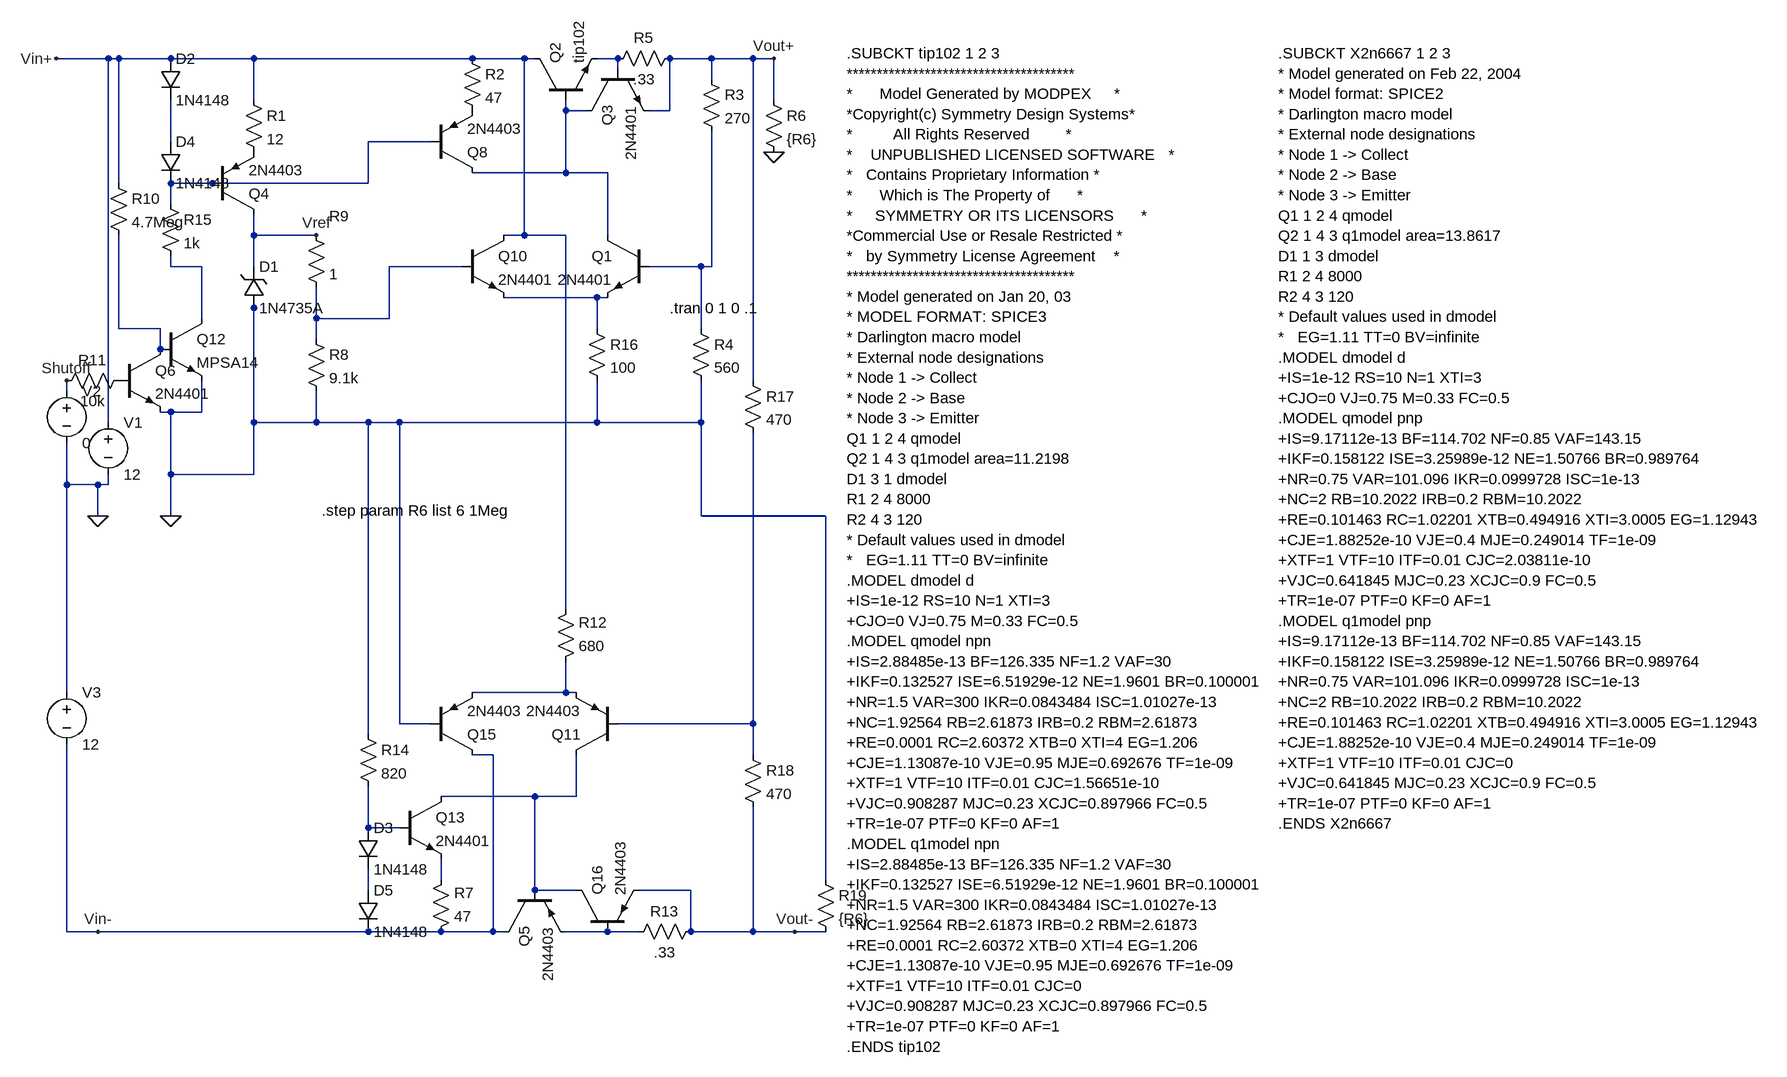
[diagram p0: schematic TrackingSupplyWithShutdown.asc]
TrackingSupplyWithShutdown.asc, the LTspice schematic file:
Version 4
SHEET 1 2144 1524
WIRE -496 -48 -576 -48
WIRE -480 -48 -496 -48
WIRE -400 -48 -480 -48
WIRE -272 -48 -400 -48
WIRE 64 -48 -272 -48
WIRE 144 -48 64 -48
WIRE 160 -48 144 -48
WIRE 288 -48 256 -48
WIRE 432 -48 368 -48
WIRE 496 -48 432 -48
WIRE 528 -48 496 -48
WIRE 288 -32 288 -48
WIRE 432 -16 432 -48
WIRE -272 16 -272 -48
WIRE 528 16 528 -48
WIRE 208 32 208 16
WIRE 240 32 208 32
WIRE 368 32 368 -48
WIRE 368 32 336 32
WIRE -400 80 -400 16
WIRE 0 80 -96 80
WIRE 208 128 208 32
WIRE 208 128 64 128
WIRE 272 128 208 128
WIRE -480 144 -480 -48
WIRE -336 144 -400 144
WIRE -96 144 -96 80
WIRE -96 144 -336 144
WIRE -400 176 -400 144
WIRE -272 224 -272 192
WIRE -176 224 -272 224
WIRE 144 224 144 -48
WIRE 144 224 112 224
WIRE 208 224 144 224
WIRE 272 224 272 128
WIRE -400 272 -400 256
WIRE -352 272 -400 272
WIRE -272 272 -272 224
WIRE 48 272 -64 272
WIRE 416 272 336 272
WIRE 432 272 432 64
WIRE 432 272 416 272
WIRE 256 320 112 320
WIRE 272 320 256 320
WIRE -272 336 -272 320
WIRE -352 352 -352 272
WIRE -176 352 -176 304
WIRE -64 352 -64 272
WIRE -64 352 -176 352
WIRE -480 368 -480 224
WIRE -416 368 -480 368
WIRE 256 368 256 320
WIRE 416 368 416 272
WIRE -176 384 -176 352
WIRE -416 400 -416 368
WIRE 496 448 496 -48
WIRE -560 464 -560 448
WIRE -400 496 -416 496
WIRE -352 496 -352 448
WIRE -352 496 -400 496
WIRE -496 512 -496 -48
WIRE -272 512 -272 336
WIRE -176 512 -176 464
WIRE -176 512 -272 512
WIRE -96 512 -176 512
WIRE -48 512 -96 512
WIRE 256 512 256 448
WIRE 256 512 -48 512
WIRE 416 512 416 448
WIRE 416 512 256 512
WIRE -400 592 -400 496
WIRE -272 592 -272 512
WIRE -272 592 -400 592
WIRE -560 608 -560 544
WIRE -512 608 -560 608
WIRE -496 608 -496 592
WIRE -496 608 -512 608
WIRE -512 656 -512 608
WIRE -400 656 -400 592
WIRE 416 656 416 512
WIRE 608 656 416 656
WIRE 208 800 208 224
WIRE -560 928 -560 608
WIRE 208 928 208 880
WIRE 208 928 64 928
WIRE 224 928 208 928
WIRE -48 976 -48 512
WIRE 0 976 -48 976
WIRE 496 976 496 528
WIRE 496 976 288 976
WIRE -96 992 -96 512
WIRE 96 1024 64 1024
WIRE 496 1024 496 976
WIRE 160 1088 16 1088
WIRE 224 1088 224 1024
WIRE 224 1088 160 1088
WIRE -96 1136 -96 1072
WIRE -48 1136 -96 1136
WIRE 16 1216 16 1184
WIRE 608 1216 608 656
WIRE -96 1232 -96 1200
WIRE 160 1232 160 1088
WIRE 224 1232 160 1232
WIRE 400 1232 320 1232
WIRE -560 1296 -560 1008
WIRE -512 1296 -560 1296
WIRE -96 1296 -512 1296
WIRE 16 1296 -96 1296
WIRE 96 1296 96 1024
WIRE 96 1296 16 1296
WIRE 112 1296 96 1296
WIRE 272 1296 208 1296
WIRE 320 1296 272 1296
WIRE 400 1296 400 1232
WIRE 496 1296 496 1104
WIRE 496 1296 400 1296
WIRE 560 1296 496 1296
WIRE 608 1296 560 1296
FLAG -576 -48 Vin+
FLAG 528 -48 Vout+
FLAG -176 224 Vref
FLAG -512 656 0
FLAG 528 96 0
FLAG -400 656 0
FLAG -560 448 Shutoff
FLAG -512 1296 Vin-
FLAG 560 1296 Vout-
SYMBOL zener -288 336 M180
WINDOW 0 24 64 Left 2
WINDOW 3 24 0 Left 2
SYMATTR InstName D1
SYMATTR Value 1N4735A
SYMBOL npn 336 224 M0
SYMATTR InstName Q1
SYMATTR Value 2N4401
SYMBOL res 416 -32 R0
SYMATTR InstName R3
SYMATTR Value 270
SYMBOL res 400 352 R0
SYMATTR InstName R4
SYMATTR Value 560
SYMBOL npn 160 16 R270
SYMATTR InstName Q2
SYMATTR Value tip102
SYMATTR Prefix X
SYMBOL voltage -496 496 R0
WINDOW 123 0 0 Left 2
WINDOW 39 0 0 Left 2
SYMATTR InstName V1
SYMATTR Value 12
SYMBOL res 384 -64 R90
WINDOW 0 0 56 VBottom 2
WINDOW 3 32 56 VTop 2
SYMATTR InstName R5
SYMATTR Value .33
SYMBOL npn 240 -32 M90
SYMATTR InstName Q3
SYMATTR Value 2N4401
SYMBOL res 512 0 R0
SYMATTR InstName R6
SYMATTR Value {R6}
SYMBOL diode -416 -48 R0
SYMATTR InstName D2
SYMATTR Value 1N4148
SYMBOL diode -416 80 R0
SYMATTR InstName D4
SYMATTR Value 1N4148
SYMBOL pnp -336 192 M180
SYMATTR InstName Q4
SYMATTR Value 2N4403
SYMBOL res -288 0 R0
SYMATTR InstName R1
SYMATTR Value 12
SYMBOL res -192 368 R0
SYMATTR InstName R8
SYMATTR Value 9.1k
SYMBOL res -192 208 R0
WINDOW 0 36 -13 Left 2
SYMATTR InstName R9
SYMATTR Value 1
SYMBOL voltage -560 448 R0
WINDOW 123 0 0 Left 2
WINDOW 39 0 0 Left 2
SYMATTR InstName V2
SYMATTR Value 0
SYMBOL pnp 0 128 M180
SYMATTR InstName Q8
SYMATTR Value 2N4403
SYMBOL res 48 -64 R0
SYMATTR InstName R2
SYMATTR Value 47
SYMBOL npn 48 224 R0
SYMATTR InstName Q10
SYMATTR Value 2N4401
SYMBOL npn -480 400 R0
SYMATTR InstName Q6
SYMATTR Value 2N4401
SYMBOL npn -416 352 R0
SYMATTR InstName Q12
SYMATTR Value MPSA14
SYMBOL res -496 128 R0
SYMATTR InstName R10
SYMATTR Value 4.7Meg
SYMBOL res -464 432 R90
WINDOW 0 0 56 VBottom 2
WINDOW 3 32 56 VTop 2
SYMATTR InstName R11
SYMATTR Value 10k
SYMBOL res -416 160 R0
SYMATTR InstName R15
SYMATTR Value 1k
SYMBOL res 240 352 R0
SYMATTR InstName R16
SYMATTR Value 100
SYMBOL pnp 288 1024 R180
SYMATTR InstName Q11
SYMATTR Value 2N4403
SYMBOL res 0 1312 M180
WINDOW 0 36 76 Left 2
WINDOW 3 36 40 Left 2
SYMATTR InstName R7
SYMATTR Value 47
SYMBOL npn -48 1088 R0
SYMATTR InstName Q13
SYMATTR Value 2N4401
SYMBOL res 192 896 M180
WINDOW 0 36 76 Left 2
WINDOW 3 36 40 Left 2
SYMATTR InstName R12
SYMATTR Value 680
SYMBOL pnp 0 1024 M180
SYMATTR InstName Q15
SYMATTR Value 2N4403
SYMBOL pnp 224 1296 R270
SYMATTR InstName Q16
SYMATTR Value 2N4403
SYMBOL res 416 1280 R90
WINDOW 0 0 56 VBottom 2
WINDOW 3 32 56 VTop 2
SYMATTR InstName R13
SYMATTR Value .33
SYMBOL voltage -560 912 R0
WINDOW 123 0 0 Left 2
WINDOW 39 0 0 Left 2
SYMATTR InstName V3
SYMATTR Value 12
SYMBOL diode -112 1136 R0
SYMATTR InstName D3
SYMATTR Value 1N4148
SYMBOL diode -112 1232 R0
SYMATTR InstName D5
SYMATTR Value 1N4148
SYMBOL res -112 976 R0
SYMATTR InstName R14
SYMATTR Value 820
SYMBOL res 480 432 R0
SYMATTR InstName R17
SYMATTR Value 470
SYMBOL res 480 1008 R0
SYMATTR InstName R18
SYMATTR Value 470
SYMBOL res 592 1200 R0
SYMATTR InstName R19
SYMATTR Value {R6}
SYMBOL pnp 112 1232 M90
SYMATTR InstName Q5
SYMATTR Value 2N4403
TEXT 368 336 Left 2 !.tran 0 1 0 .1
TEXT 640 -56 Left 2 !.SUBCKT tip102 1 2 3\n**************************************\n*      Model Generated by MODPEX     *\n*Copyright(c) Symmetry Design Systems*\n*         All Rights Reserved        *\n*    UNPUBLISHED LICENSED SOFTWARE   *\n*   Contains Proprietary Information *\n*      Which is The Property of      *\n*     SYMMETRY OR ITS LICENSORS      *\n*Commercial Use or Resale Restricted *\n*   by Symmetry License Agreement    *\n**************************************\n* Model generated on Jan 20, 03\n* MODEL FORMAT: SPICE3\n* Darlington macro model\n* External node designations\n* Node 1 -> Collect\n* Node 2 -> Base\n* Node 3 -> Emitter\nQ1 1 2 4 qmodel\nQ2 1 4 3 q1model area=11.2198\nD1 3 1 dmodel\nR1 2 4 8000\nR2 4 3 120\n* Default values used in dmodel\n*   EG=1.11 TT=0 BV=infinite\n.MODEL dmodel d\n+IS=1e-12 RS=10 N=1 XTI=3\n+CJO=0 VJ=0.75 M=0.33 FC=0.5\n.MODEL qmodel npn\n+IS=2.88485e-13 BF=126.335 NF=1.2 VAF=30\n+IKF=0.132527 ISE=6.51929e-12 NE=1.9601 BR=0.100001\n+NR=1.5 VAR=300 IKR=0.0843484 ISC=1.01027e-13\n+NC=1.92564 RB=2.61873 IRB=0.2 RBM=2.61873\n+RE=0.0001 RC=2.60372 XTB=0 XTI=4 EG=1.206\n+CJE=1.13087e-10 VJE=0.95 MJE=0.692676 TF=1e-09\n+XTF=1 VTF=10 ITF=0.01 CJC=1.56651e-10\n+VJC=0.908287 MJC=0.23 XCJC=0.897966 FC=0.5\n+TR=1e-07 PTF=0 KF=0 AF=1\n.MODEL q1model npn\n+IS=2.88485e-13 BF=126.335 NF=1.2 VAF=30\n+IKF=0.132527 ISE=6.51929e-12 NE=1.9601 BR=0.100001\n+NR=1.5 VAR=300 IKR=0.0843484 ISC=1.01027e-13\n+NC=1.92564 RB=2.61873 IRB=0.2 RBM=2.61873\n+RE=0.0001 RC=2.60372 XTB=0 XTI=4 EG=1.206\n+CJE=1.13087e-10 VJE=0.95 MJE=0.692676 TF=1e-09\n+XTF=1 VTF=10 ITF=0.01 CJC=0\n+VJC=0.908287 MJC=0.23 XCJC=0.897966 FC=0.5\n+TR=1e-07 PTF=0 KF=0 AF=1\n.ENDS tip102
TEXT -168 648 Left 2 !.step param R6 list 6 1Meg
TEXT 1304 -56 Left 2 !.SUBCKT X2n6667 1 2 3\n* Model generated on Feb 22, 2004\n* Model format: SPICE2\n* Darlington macro model\n* External node designations\n* Node 1 -> Collect\n* Node 2 -> Base\n* Node 3 -> Emitter\nQ1 1 2 4 qmodel\nQ2 1 4 3 q1model area=13.8617\nD1 1 3 dmodel\nR1 2 4 8000\nR2 4 3 120\n* Default values used in dmodel\n*   EG=1.11 TT=0 BV=infinite\n.MODEL dmodel d\n+IS=1e-12 RS=10 N=1 XTI=3\n+CJO=0 VJ=0.75 M=0.33 FC=0.5\n.MODEL qmodel pnp\n+IS=9.17112e-13 BF=114.702 NF=0.85 VAF=143.15\n+IKF=0.158122 ISE=3.25989e-12 NE=1.50766 BR=0.989764\n+NR=0.75 VAR=101.096 IKR=0.0999728 ISC=1e-13\n+NC=2 RB=10.2022 IRB=0.2 RBM=10.2022\n+RE=0.101463 RC=1.02201 XTB=0.494916 XTI=3.0005 EG=1.12943\n+CJE=1.88252e-10 VJE=0.4 MJE=0.249014 TF=1e-09\n+XTF=1 VTF=10 ITF=0.01 CJC=2.03811e-10\n+VJC=0.641845 MJC=0.23 XCJC=0.9 FC=0.5\n+TR=1e-07 PTF=0 KF=0 AF=1\n.MODEL q1model pnp\n+IS=9.17112e-13 BF=114.702 NF=0.85 VAF=143.15\n+IKF=0.158122 ISE=3.25989e-12 NE=1.50766 BR=0.989764\n+NR=0.75 VAR=101.096 IKR=0.0999728 ISC=1e-13\n+NC=2 RB=10.2022 IRB=0.2 RBM=10.2022\n+RE=0.101463 RC=1.02201 XTB=0.494916 XTI=3.0005 EG=1.12943\n+CJE=1.88252e-10 VJE=0.4 MJE=0.249014 TF=1e-09\n+XTF=1 VTF=10 ITF=0.01 CJC=0\n+VJC=0.641845 MJC=0.23 XCJC=0.9 FC=0.5\n+TR=1e-07 PTF=0 KF=0 AF=1\n.ENDS X2n6667

The netlist it stands for:
* TrackingSupplyWithShutdown.asc
D1 0 Vref 1N4735A
Q1 N002 N007 N008 0 2N4401
R3 Vout+ N007 270
R4 N007 0 560
XQ2 Vin+ N002 N001 tip102  ; pins C B E
V1 Vin+ 0 12
R5 Vout+ N001 .33
Q3 N002 N001 Vout+ 0 2N4401
R6 Vout+ 0 {R6}
D2 Vin+ N003 1N4148
D4 N003 N004 1N4148
Q4 Vref N004 P001 0 2N4403
R1 Vin+ P001 12
R8 N006 0 9.1k
R9 Vref N006 1
V2 Shutoff 0 0
Q8 N002 N004 P002 0 2N4403
R2 Vin+ P002 47
Q10 Vin+ N006 N008 0 2N4401
Q6 N009 P003 0 0 2N4401
Q12 N005 N009 0 0 MPSA14
R10 Vin+ N009 4.7Meg
R11 P003 Shutoff 10k
R15 N004 N005 1k
R16 N008 0 100
Q11 N012 N011 N010 0 2N4403
R7 Vin- N014 47
Q13 N012 N013 N014 0 2N4401
R12 N010 Vin+ 680
Q15 Vin- 0 N010 0 2N4403
Q16 N012 N016 Vout- 0 2N4403
R13 Vout- N016 .33
V3 0 Vin- 12
D3 N013 N015 1N4148
D5 N015 Vin- 1N4148
R14 0 N013 820
R17 Vout+ N011 470
R18 N011 Vout- 470
R19 0 Vout- {R6}
Q5 Vin- N012 N016 0 2N4403
.model D D
.lib standard.dio
.model NPN NPN
.model PNP PNP
.lib standard.bjt
.tran 0 1 0 .1
.SUBCKT tip102 1 2 3
**************************************
*      Model Generated by MODPEX     *
*Copyright(c) Symmetry Design Systems*
*         All Rights Reserved        *
*    UNPUBLISHED LICENSED SOFTWARE   *
*   Contains Proprietary Information *
*      Which is The Property of      *
*     SYMMETRY OR ITS LICENSORS      *
*Commercial Use or Resale Restricted *
*   by Symmetry License Agreement    *
**************************************
* Model generated on Jan 20, 03
* MODEL FORMAT: SPICE3
* Darlington macro model
* External node designations
* Node 1 -> Collect
* Node 2 -> Base
* Node 3 -> Emitter
Q1 1 2 4 qmodel
Q2 1 4 3 q1model area=11.2198
D1 3 1 dmodel
R1 2 4 8000
R2 4 3 120
* Default values used in dmodel
*   EG=1.11 TT=0 BV=infinite
.MODEL dmodel d
+IS=1e-12 RS=10 N=1 XTI=3
+CJO=0 VJ=0.75 M=0.33 FC=0.5
.MODEL qmodel npn
+IS=2.88485e-13 BF=126.335 NF=1.2 VAF=30
+IKF=0.132527 ISE=6.51929e-12 NE=1.9601 BR=0.100001
+NR=1.5 VAR=300 IKR=0.0843484 ISC=1.01027e-13
+NC=1.92564 RB=2.61873 IRB=0.2 RBM=2.61873
+RE=0.0001 RC=2.60372 XTB=0 XTI=4 EG=1.206
+CJE=1.13087e-10 VJE=0.95 MJE=0.692676 TF=1e-09
+XTF=1 VTF=10 ITF=0.01 CJC=1.56651e-10
+VJC=0.908287 MJC=0.23 XCJC=0.897966 FC=0.5
+TR=1e-07 PTF=0 KF=0 AF=1
.MODEL q1model npn
+IS=2.88485e-13 BF=126.335 NF=1.2 VAF=30
+IKF=0.132527 ISE=6.51929e-12 NE=1.9601 BR=0.100001
+NR=1.5 VAR=300 IKR=0.0843484 ISC=1.01027e-13
+NC=1.92564 RB=2.61873 IRB=0.2 RBM=2.61873
+RE=0.0001 RC=2.60372 XTB=0 XTI=4 EG=1.206
+CJE=1.13087e-10 VJE=0.95 MJE=0.692676 TF=1e-09
+XTF=1 VTF=10 ITF=0.01 CJC=0
+VJC=0.908287 MJC=0.23 XCJC=0.897966 FC=0.5
+TR=1e-07 PTF=0 KF=0 AF=1
.ENDS tip102
.step param R6 list 6 1Meg
.SUBCKT X2n6667 1 2 3
* Model generated on Feb 22, 2004
* Model format: SPICE2
* Darlington macro model
* External node designations
* Node 1 -> Collect
* Node 2 -> Base
* Node 3 -> Emitter
Q1 1 2 4 qmodel
Q2 1 4 3 q1model area=13.8617
D1 1 3 dmodel
R1 2 4 8000
R2 4 3 120
* Default values used in dmodel
*   EG=1.11 TT=0 BV=infinite
.MODEL dmodel d
+IS=1e-12 RS=10 N=1 XTI=3
+CJO=0 VJ=0.75 M=0.33 FC=0.5
.MODEL qmodel pnp
+IS=9.17112e-13 BF=114.702 NF=0.85 VAF=143.15
+IKF=0.158122 ISE=3.25989e-12 NE=1.50766 BR=0.989764
+NR=0.75 VAR=101.096 IKR=0.0999728 ISC=1e-13
+NC=2 RB=10.2022 IRB=0.2 RBM=10.2022
+RE=0.101463 RC=1.02201 XTB=0.494916 XTI=3.0005 EG=1.12943
+CJE=1.88252e-10 VJE=0.4 MJE=0.249014 TF=1e-09
+XTF=1 VTF=10 ITF=0.01 CJC=2.03811e-10
+VJC=0.641845 MJC=0.23 XCJC=0.9 FC=0.5
+TR=1e-07 PTF=0 KF=0 AF=1
.MODEL q1model pnp
+IS=9.17112e-13 BF=114.702 NF=0.85 VAF=143.15
+IKF=0.158122 ISE=3.25989e-12 NE=1.50766 BR=0.989764
+NR=0.75 VAR=101.096 IKR=0.0999728 ISC=1e-13
+NC=2 RB=10.2022 IRB=0.2 RBM=10.2022
+RE=0.101463 RC=1.02201 XTB=0.494916 XTI=3.0005 EG=1.12943
+CJE=1.88252e-10 VJE=0.4 MJE=0.249014 TF=1e-09
+XTF=1 VTF=10 ITF=0.01 CJC=0
+VJC=0.641845 MJC=0.23 XCJC=0.9 FC=0.5
+TR=1e-07 PTF=0 KF=0 AF=1
.ENDS X2n6667
.backanno
.end